# Altium schematic sheet ClosedLoop_Drive_UI_Display.SchDoc
size A4; SheetNumber: 8; SheetTotal: 8
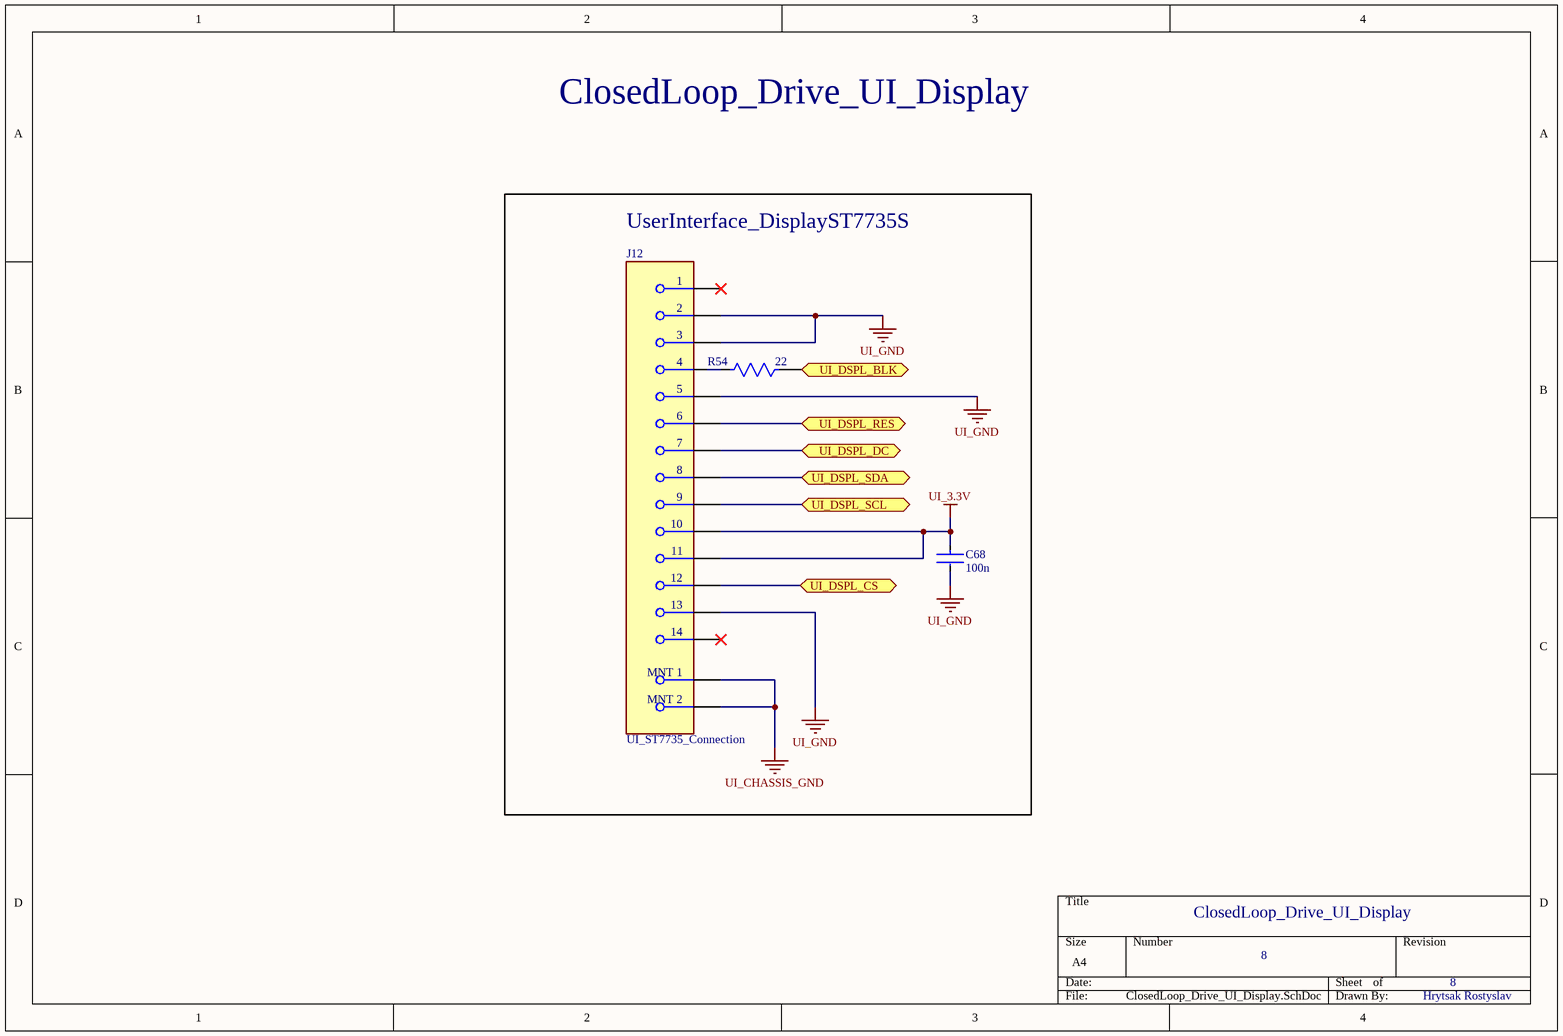
[diagram p0: ClosedLoop_Drive_UI_Display.SchDoc]

## Parts
C68  100n  [FP-0805-L_2_01_0_2-W_1_25-MFG]
J12  UI_ST7735_Connection  [FP-TF31-14S-0_5SH_800-MFG]
R54  22  [FP-MCU0805-IPC_A]

## Blocks framed on the sheet
UserInterface_DisplayST7735S: C68 J12 R54

## Ports
UI_DSPL_BLK (bidir, see ClosedLoop_Drive_UserInterface[3C]), UI_DSPL_CS (bidir, see ClosedLoop_Drive_UserInterface[1C]), UI_DSPL_DC (bidir, see ClosedLoop_Drive_UserInterface[3C]), UI_DSPL_RES (bidir, see ClosedLoop_Drive_UserInterface[3C]), UI_DSPL_SCL (bidir, see ClosedLoop_Drive_UserInterface[1C]), UI_DSPL_SDA (bidir, see ClosedLoop_Drive_UserInterface[1C])

## Nets
UI_3.3V: C68.1 J12.10 J12.11
UI_CHASSIS_GND: J12.15(MNT_1) J12.16(MNT_2)
UI_GND: C68.2 J12.2 J12.3 J12.5 J12.13
UI_DSPL_BLK: R54.1 ; port UI_DSPL_BLK
UI_DSPL_CS: J12.12 ; port UI_DSPL_CS
UI_DSPL_DC: J12.7 ; port UI_DSPL_DC
UI_DSPL_RES: J12.6 ; port UI_DSPL_RES
UI_DSPL_SCL: J12.9 ; port UI_DSPL_SCL
UI_DSPL_SDA: J12.8 ; port UI_DSPL_SDA
NetJ12_4: J12.4 R54.2

Not connected (* = marked no-connect by the designer): J12 1* 14*

## Notes on the sheet
- ClosedLoop_Drive_UI_Display
- 8
- Hrytsak Rostyslav

## Library data of the parts
C68 = CMP-07738-122049624-1: 0805; Tolerance: 10%; Dielectric: X7R; Material: Ceramic; Voltage Rating (DC): 100V; Capacitance: 1µF; Case/Package: 0805; Height: 1.4mm; Voltage Rating: 100V; Schedule B: 8532240020; NexarPartId: 122049624; RoHS: Compliant; Lifecycle Status: Production; Min Operating Temperature: -55°C; Max Operating Temperature: 125°C
J12 = CMP-11609-000035-1: CONN FFC 14POS 0.50MM SMD; RoHS Compliant: Yes
R54 = CMP-02407-001153-1: 0805; Power Rating: 200mW; Temperature Coefficient: 25ppm/°C; Voltage Rating: 150V; Resistance: 4.99kR; Tolerance: 0.5%; Case Code (Imperial): 0805; Features: Automotive AEC-Q200; Case Code (Metric): 2012; Weight: 0.000162oz; Width: 0.049inch; Packaging: Tape and Reel; Composition: Thin Film; Height: 0.024inch; Termination: SMD/SMT; Number of Terminations: 2; Min Operating Temperature: -55°C; Length: 0.079inch; Package Quantity: 5000; Max Operating Temperature: 175°C; Case/Package: 0805; Max Power Dissipation: 200mW